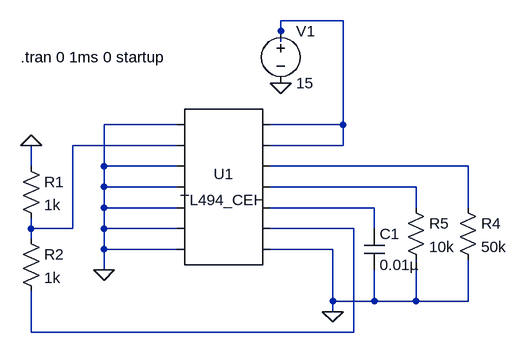
[diagram p0: schematic run_TL494_test_CEH_2021.asc]
run_TL494_test_CEH_2021.asc, the LTspice schematic file:
Version 4
SHEET 1 880 680
WIRE 208 -112 112 -112
WIRE 112 -96 112 -112
WIRE 112 -80 112 -96
WIRE -48 48 -160 48
WIRE 208 48 208 -112
WIRE 208 48 96 48
WIRE -48 80 -208 80
WIRE 208 80 208 48
WIRE 208 80 96 80
WIRE -272 112 -272 80
WIRE -160 112 -160 48
WIRE -48 112 -160 112
WIRE 400 112 96 112
WIRE -160 144 -160 112
WIRE -48 144 -160 144
WIRE 320 144 96 144
WIRE -160 176 -160 144
WIRE -48 176 -160 176
WIRE 256 176 96 176
WIRE 320 176 320 144
WIRE 400 176 400 112
WIRE -272 208 -272 192
WIRE -208 208 -208 80
WIRE -208 208 -272 208
WIRE -160 208 -160 176
WIRE -48 208 -160 208
WIRE 224 208 96 208
WIRE 256 208 256 176
WIRE -272 224 -272 208
WIRE -160 240 -160 208
WIRE -48 240 -160 240
WIRE 192 240 96 240
WIRE -160 272 -160 240
WIRE 192 320 192 240
WIRE 256 320 256 272
WIRE 256 320 192 320
WIRE 320 320 320 256
WIRE 320 320 256 320
WIRE 400 320 400 256
WIRE 400 320 320 320
WIRE 192 336 192 320
WIRE -272 368 -272 304
WIRE 224 368 224 208
WIRE 224 368 -272 368
FLAG -272 80 0
FLAG 112 -16 0
FLAG 192 336 0
FLAG -160 272 0
SYMBOL res -288 96 R0
SYMATTR InstName R1
SYMATTR Value 1k
SYMBOL res -288 208 R0
SYMATTR InstName R2
SYMATTR Value 1k
SYMBOL res 384 160 R0
SYMATTR InstName R4
SYMATTR Value 50k
SYMBOL res 304 160 R0
SYMATTR InstName R5
SYMATTR Value 10k
SYMBOL cap 240 208 R0
SYMATTR InstName C1
SYMATTR Value 0.01µ
SYMBOL voltage 112 -112 R0
WINDOW 123 0 0 Left 2
WINDOW 39 0 0 Left 2
SYMATTR InstName V1
SYMATTR Value 15
SYMBOL AutoGenerated\\TL494_CEH 16 144 R0
SYMATTR InstName U1
TEXT -288 -56 Left 2 !.tran 0 1ms 0 startup

The netlist it stands for:
* run_TL494_test_CEH_2021.asc
R1 0 N002 1k
R2 N002 N006 1k
R4 N003 0 50k
R5 N004 0 10k
C1 N005 0 0.01µ
V1 N001 0 15
* U1: TL494_CEH (symbol AutoGenerated\TL494_CEH not available, pins judged from their places): pin1=0 pin2=N002 pin3=0 pin4=0 pin5=0 pin6=0 pin7=0 pin8=N001 pin9=N001 pin10=N003 pin11=N004 pin12=N005 pin13=N006 pin14=0
.tran 0 1ms 0 startup
.backanno
.end